# Altium project power-v3.6.PrjPCB (part 2 of 2)

## Sheet HV-Measurement.SchDoc
size A4; SheetNumber: 6
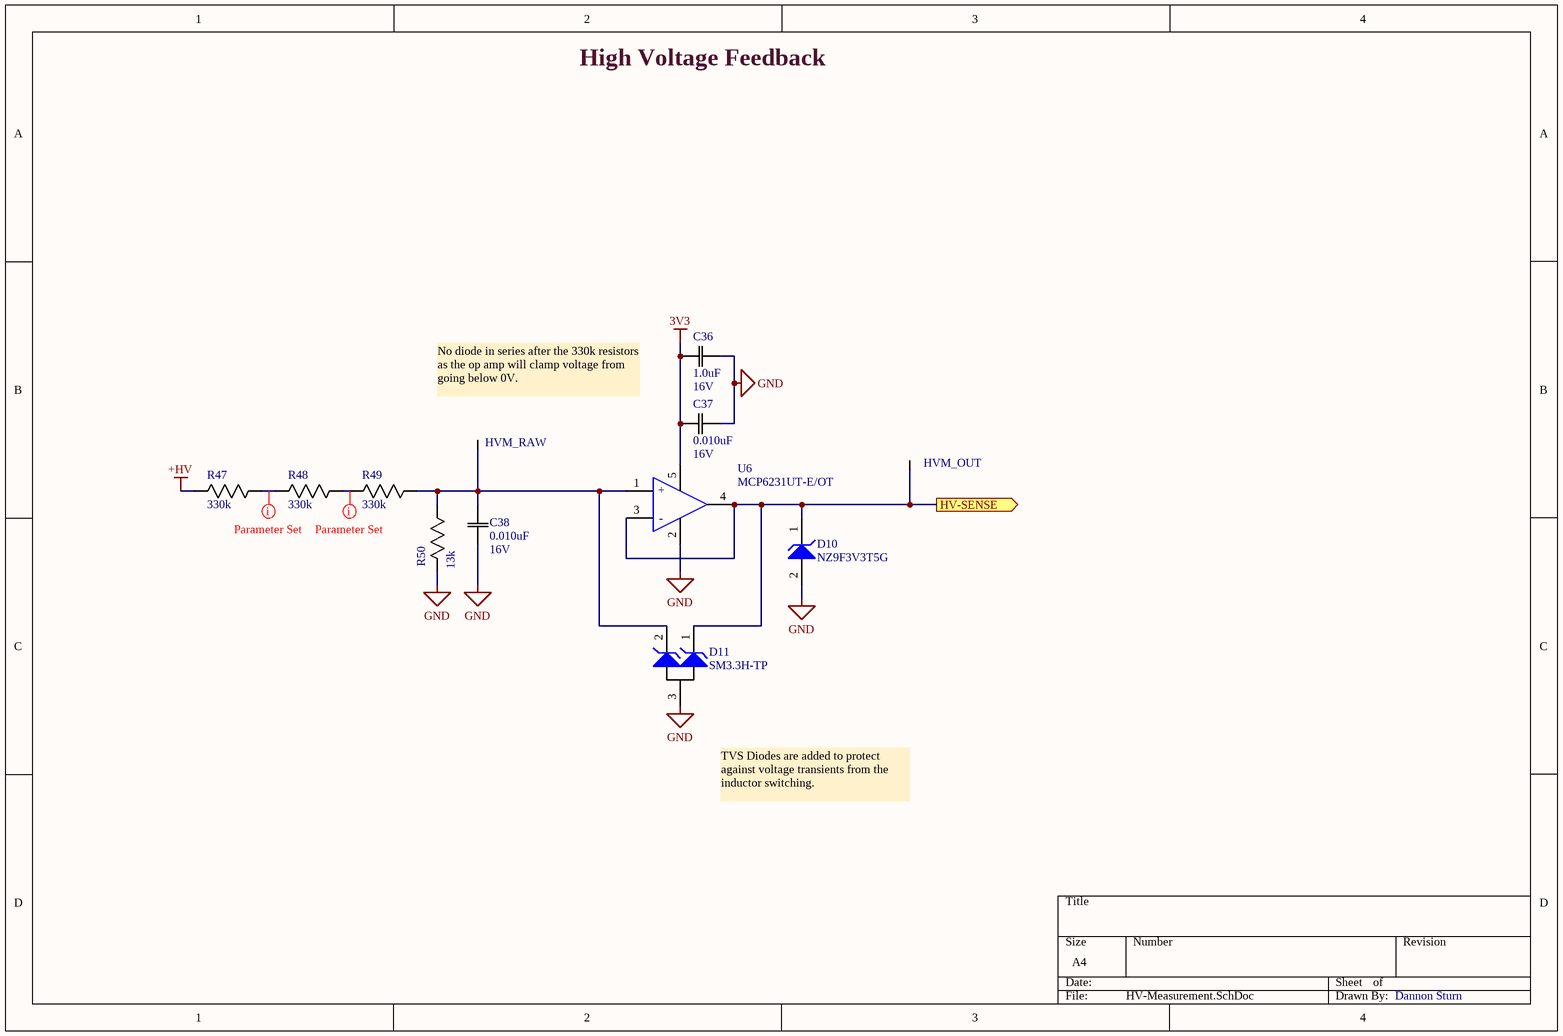
[diagram p7: HV-Measurement.SchDoc]

### Parts
C36  Rating: 16V  [0603]  (hidden comment: 1.0uF)
C37  Rating: 16V  [0603]  (hidden comment: 0.010uF)
C38  Rating: 16V  [0603]  (hidden comment: 0.010uF)
D10  NZ9F3V3T5G  [SOD-923_0P6X0P85_ONS]
D11  SM3.3H-TP  [SOT-23A-3]
HVM_OUT  Test Point (Via)  [TP]  (value not drawn)  (no BOM)
HVM_RAW  Test Point (Via)  [TP]  (value not drawn)  (no BOM)
R47  330k  [0603]
R48  330k  [0603]
R49  330k  [0603]
R50  13k  [0603]
U6  MCP6231UT-E/OT  [SOT-23-5_MC_MCH-L]

### Ports
HV-SENSE (out)

### Nets
3V3: C36.2(C2) C37.1(C1) U6.5(V+)
+HV: R47.2(R2)
GND: C36.1(C1) C37.2(C2) C38.1(C1) D10.2(A) D11.3 R50.2(R2) U6.2(V-)
HV-SENSE: D10.1(K) D11.1 HVM_OUT.1 U6.3(IN-) U6.4(OUT) ; port HV-SENSE
NetC38_2: C38.2(C2) D11.2 HVM_RAW.1 R49.1(R1) R50.1(R1) U6.1(IN+)
NetR47_1: R47.1(R1) R48.2(R2)
NetR48_1: R48.1(R1) R49.2(R2)

### Layout directives
net class HighVoltage: NetR47_1, NetR48_1

### Notes on the sheet
- High Voltage Feedback
- No diode in series after the 330k resistors as the op amp will clamp voltage from going below 0V.
- TVS Diodes are added to protect against voltage transients from the inductor switching.
- Dannon Sturn
- (in symbol OP AMP MCP6231UT-E_OT) +; -

### Library data of the parts
C36 = CAP 1.0uF 16V: CAP CER 1.0UF 16V X5R 0603/0805; Tolerance: 10%; Package: 0603/0805; Temperature Coefficient: X5R; Operating Temperature: -55°C ~ 85°C; Value: 1.0uF; Part Number: CAP 1.0uF 16V
C37 C38 = CAP 0.010uF 16V: CAP CER 0.010UF 16V X5R 0603; Tolerance: 10%; Temperature Coefficient: X5R; Value: 0.010uF; Part Number: CAP 0.010uF 16V; Package: 0603/0805; Operating Temperature: -55°C ~ 85°C
D10 = DIODE ZENER 3.3 200mW: Zener Diode 3.3 V 200 mW ±5% Surface Mount SOD-923; Mfr_Name: ON Semiconductor; Type: DEV; Copyright: Copyright (C) 2021 Ultra Librarian. All rights reserved.; Manufacturer_Part_Number: NZ9F3V3T5G; Digi-Key_Part_Number_1: NZ9F3V3T5GOSTR-ND; Digi-Key_Part_Number_2: NZ9F3V3T5GOSCT-ND; Digi-Key_Part_Number_3: NZ9F3V3T5GOSDKR-ND; RefDes: RefDes; Supplier 1: Digi-Key; Supplier Part Number 1: NZ9F3V3T5GOSCT-ND; Part Number: DIODE ZENER 3.3 200mW; Manufacturer Part Number 1: NZ9F3V3T5G; Supplier URL 1: https://www.digikey.com/en/products/detail/onsemi/NZ9F3V3T5G/1961325
D11 = DIODE TVS 3.3VR 3.5VBR: 3.3V Reverese Standoff, 3.5V Breakdown, 12.5V Clamp 40A (8/20µs) Ipp Tvs Diode SMD SOT-23; ComponentLink1Description: Octopart Link; ComponentLink1URL: https://octopart.com/search?q=SM3.3H-TP&currency=USD&specs=0; Part Number: DIODE TVS 3.3VR 3.5VBR; Manufacturer Part Number 1: SM3.3H-TP; Supplier 1: Digi-Key; Supplier Part Number 1: 353-SM3.3H-TPCT-ND; Supplier URL 1: https://www.digikey.com/en/products/detail/micro-commercial-co/SM3-3H-TP/12177181
R47-R49 = RES 330k 1/8W - 1%: RES SMD 274K OHM 1% 1/8W 0603; Part Number: RES 330k 1/8W - 1%
R50 = RES 13k 1/8W: RES SMD 13K OHM 5% 1/8W 0603; Power (Watts): 0.125W; Package: 0805; Value: 13k; Tolerance: 5%; Part Number: RES 13k 1/8W
U6 = OP AMP MCP6231UT-E_OT: Mfr_Name: Microchip; Copyright: Copyright (C) 2021 Ultra Librarian. All rights reserved.; Manufacturer_Part_Number: MCP6231UT-E/OT; Digi-Key_Part_Number_1: MCP6231UT-E/OTCT-ND; Digi-Key_Part_Number_2: MCP6231UT-E/OTDKR-ND; Digi-Key_Part_Number_3: MCP6231UT-E/OTTR-ND; RefDes: RefDes; Type: DEV; Supplier 1: Digi-key; Supplier Part Number 1: MCP6231UT-E/OTCT-ND; Part Number: OP AMP MCP6231UT-E_OT; Manufacturer Part Number 1: MCP6231UT-E/OT; Supplier URL 1: https://www.digikey.ca/en/products/detail/microchip-technology/MCP6231UT-E-OT/716023
HVM_OUT HVM_RAW = Test Point (Via): Part Number: Test Point (Via)

## Sheet power-input.SchDoc
size A4; SheetNumber: 2
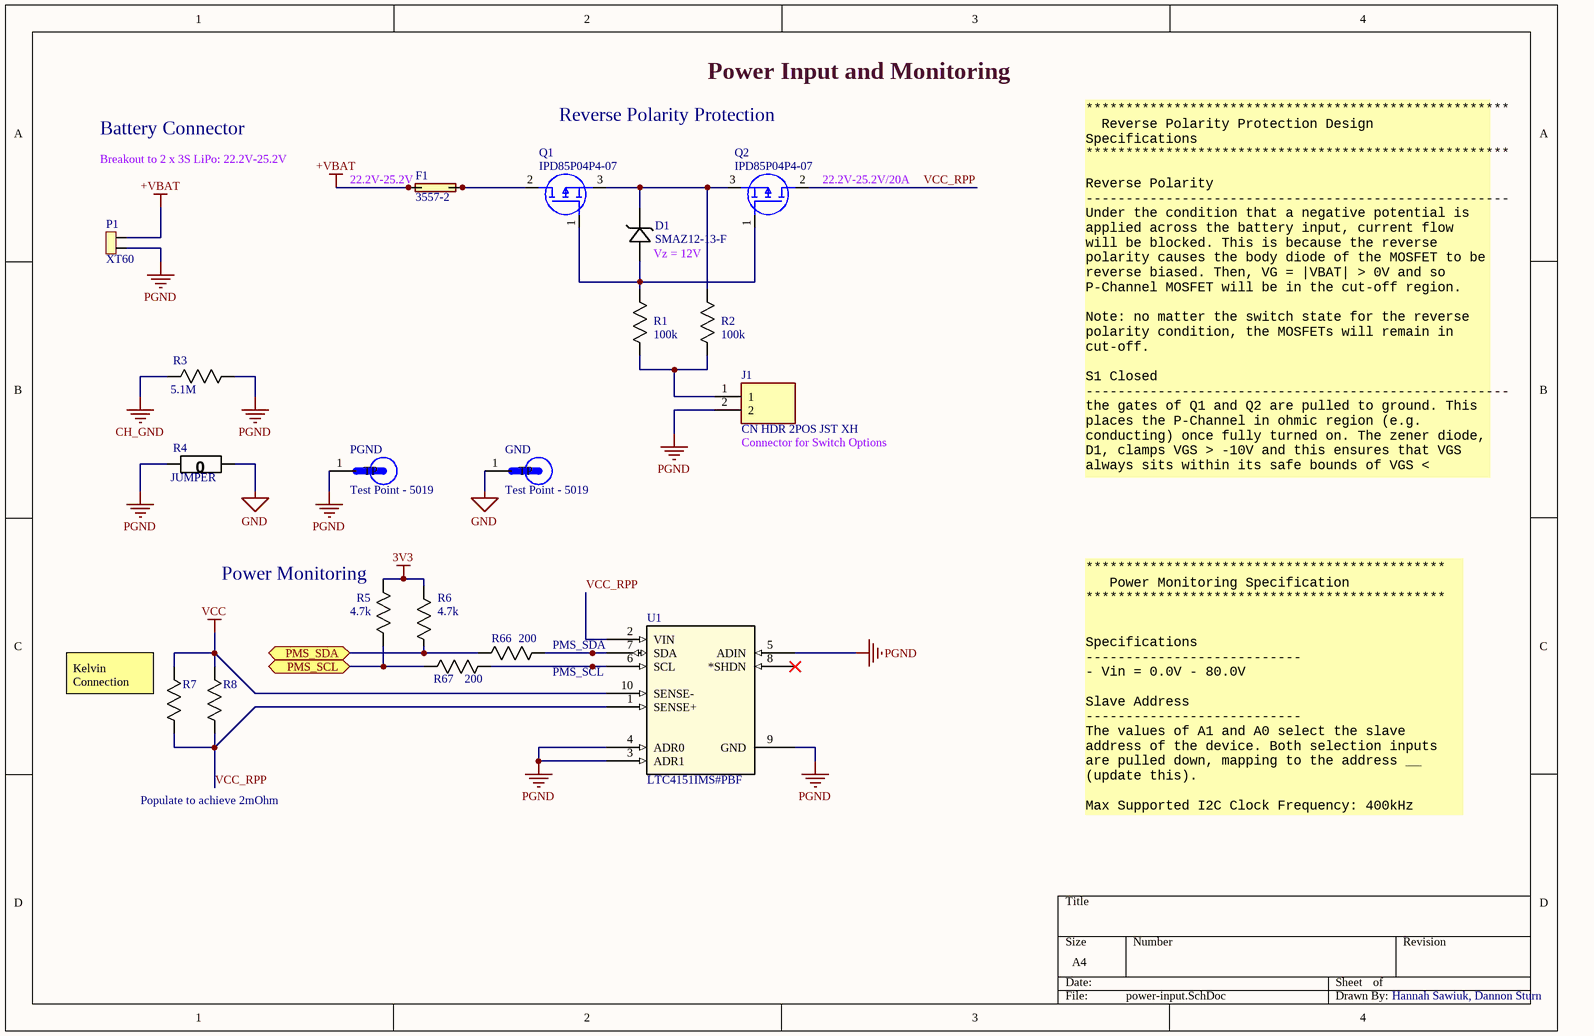
[diagram p8: power-input.SchDoc]

### Parts
D1  SMAZ12-13-F  [SMA_DIO-L]
F1  3557-2  [FUSE-3549-2]
GND  Test Point - 5019  [TP380X203]
J1  CN HDR 2POS JST XH  [JST_S2B-XH-A(LF)(SN)]
P1  XT60  [Amass_XT60PW-M]
PGND  Test Point - 5019  [TP380X203]
PMS_SCL  Test Point (Via)  [TP]  (value not drawn)  (no BOM)
PMS_SDA  Test Point (Via)  [TP]  (value not drawn)  (no BOM)
Q1  IPD85P04P4-07  [DPAK (TO-252)]
Q2  IPD85P04P4-07  [DPAK (TO-252)]
R1  100k  [0603]
R2  100k  [0603]
R3  5.1M  [0603]
R4  JUMPER  [1210]
R5  4.7k  [0603]
R6  4.7k  [0603]
R7  2mOHM  [2512]  (value not drawn)
R8  2mOHM  [2512]  (value not drawn)
R66  200  [0603]
R67  200  [0603]
U1  LTC4151IMS#PBF  [MSOP-10_MS_LIT]

### Ports
PMS_SCL (bidir), PMS_SDA (bidir)

### Nets
3V3: R5.2(R2) R6.2(R2)
+VBAT: F1.3(2A) F1.4(2B) P1.2
CH_GND: R3.2(R2)
GND: GND.1(TP) R4.1(R1)
PGND: J1.2 P1.1 PGND.1(TP) R3.1(R1) R4.2(R2) U1.3(ADR1) U1.4(ADR0) U1.5(ADIN) U1.9(GND)
VCC: R7.1(R1) R8.1(R1) U1.10(SENSE-)
PMS_SCL: R5.1(R1) R67.2(R2) ; port PMS_SCL
PMS_SDA: R6.1(R1) R66.2(R2) ; port PMS_SDA
VCC_RPP: Q2.2(D) R7.2(R2) R8.2(R2) U1.1(SENSE+) U1.2(VIN)
NetD1_1: D1.1 Q1.3(S) Q2.3(S) R2.1(R1)
NetD1_2: D1.2 Q1.1(G) Q2.1(G) R1.1(R1)
NetF1_1: F1.1(1A) F1.2(1B) Q1.2(D)
NetJ1_1: J1.1 R1.2(R2) R2.2(R2)
NetPMS_SCL_1: PMS_SCL.1 R67.1(R1) U1.6(SCL)
NetPMS_SDA_1: PMS_SDA.1 R66.1(R1) U1.7(SDA)

Not connected (* = marked no-connect by the designer): U1 8(*SHDN)*

### Notes on the sheet
- Power Input and Monitoring
- Battery Connector
- Breakout to 2 x 3S LiPo: 22.2V-25.2V
- Reverse Polarity Protection
- (near F1) 22.2V-25.2V
- (near Q2) 22.2V-25.2V/20A
- (near D1) Vz = 12V
- (near J1) Connector for Switch Options
- *****************************************************
  Reverse Polarity Protection Design Specifications
  *****************************************************
  Reverse Polarity
  -----------------------------------------------------
  Under the condition that a negative potential is applied across the battery input, current flow will be blocked. This is because the reverse polarity causes the body diode of the MOSFET to be reverse biased. Then, VG = |VBAT| > 0V and so P-Channel MOSFET will be in the cut-off region.
  Note: no matter the switch state for the reverse polarity condition, the MOSFETs will remain in cut-off.
  S1 Closed
  -----------------------------------------------------
  the gates of Q1 and Q2 are pulled to ground. This places the P-Channel in ohmic region (e.g. conducting) once fully turned on. The zener diode, D1, clamps VGS > -10V and this ensures that VGS always sits within its safe bounds of VGS < +5/-16V.
- (near R5) Power Monitoring
- (near R7) Kelvin Connection
- Populate to achieve 2mOhm
- *********************************************
  Power Monitoring Specification
  *********************************************
  Specifications
  ---------------------------
  - Vin = 0.0V - 80.0V
  Slave Address
  ---------------------------
  The values of A1 and A0 select the slave address of the device. Both selection inputs are pulled down, mapping to the address __ (update this).
  Max Supported I2C Clock Frequency: 400kHz
- Hannah Sawiuk, Dannon Sturn

### Library data of the parts
D1 = DIODE ZENER 12V 1W: Zener Diode 12 V 1 W ±5% Surface Mount SMA; Mfr_Name: Diodes Inc; Type: DEV; Copyright: Copyright (C) 2021 Ultra Librarian. All rights reserved.; Manufacturer_Part_Number: SMAZ12-13-F; Digi-Key_Part_Number_1: SMAZ12-FDICT-ND; Digi-Key_Part_Number_2: SMAZ12-FDIDKR-ND; Digi-Key_Part_Number_3: SMAZ12-FDITR-ND; RefDes: RefDes; Supplier 1: Digi-Key; Supplier 2: Newark; Supplier 3: Digi-Key; Supplier Part Number 1: SMAZ12-FDICT-ND; Supplier Part Number 2: 23T8541; Supplier Part Number 3: SMAZ12-FDICT-ND; Part Number: DIODE ZENER 12V 1W; Manufacturer Part Number 1: SMAZ12-13-F; Supplier URL 1: https://www.digikey.com/en/products/detail/SMAZ12-13-F/SMAZ12-FDICT-ND/725073?curr=usd&utm_campaign=buynow&utm_medium=aggregator&utm_source=octopart
F1 = FUSE BLADE: Fuse Block 30A 500V 1 Circuit Blade Through Hole; MF: Keystone Electronics; Package: Nonstandard Keystone; Value: *; Price: None; MP: 3557-2; SnapEDA_Link: https://www.snapeda.com/parts/3557-2/Keystone%20Electronics/view-part/278060/?ref=snap; Supplier 1: Digi-Key; Supplier Part Number 1: 36-3557-2-ND; Part Number: FUSE BLADE; Pin Count: 4
GND PGND = Test Point - 5019: PC Test Point, Miniature Phosphor Bronze, Silver Plating Surface Mount Mounting Type; MP: 5019; MF: Keystone Electronics; Value: *; Package: 2010 Keystone; Part Number: Test Point - 5019
J1 = CN HDR 2POS JST XH: Connector Header Through Hole 2 position 0.098 _2.50mm_ / JST XH; MP: B2B-XH-A_LF__SN_; MF: JST Sales; Price: None; Package: None; Value: *; SnapEDA_Link: https://www.snapeda.com/parts/B2B-XH-A%28LF%29%28SN%29/JST%20Sales%20America%20Inc./view-part/492310/?ref=snap; Part Number: CN HDR 2POS JST XH; Pin Count: 2
P1 = XT60 Connector: XT60 CONNECTORS FEMALE PAIR; MF: SparkFun Electronics; MP: PRT-10474; Digikey: 1568-1816-ND; Digikey Link: https://www.digikey.ca/product-detail/en/sparkfun-electronics/PRT-10474/1568-1816-ND/8258064; Package: XT60; Price: 2.13000 CAD; Value: N/A; Supplier 1: Digi-Key; Supplier Part Number 1: 1568-1816-ND; Part Number: XT60 Connector; Supplier URL 1: https://www.digikey.ca/product-detail/en/sparkfun-electronics/PRT-10474/1568-1816-ND/8258064; Pin Count: 2
Q1 Q2 = MOSFET IPD85P04P4-07: P-Channel 40 V 85A (Tc) 88W (Tc) Surface Mount PG-TO252-3-313; Supplier 1: Digi-Key; Supplier 2: Mouser; Supplier 3: Digi-Key; Supplier Part Number 1: 448-IPD85P04P407ATMA1CT-ND; Supplier Part Number 2: 726-IPD85P04P4-07; Supplier Part Number 3: 448-IPD85P04P407ATMA1CT-ND; Part Number: MOSFET IPD85P04P4-07; Supplier URL 1: https://www.digikey.ca/en/products/detail/infineon-technologies/IPD85P04P407ATMA1/5960266
R1 R2 = RES 100k 1/8W - 1%: RES SMD 100K OHM 1% 1/8W 0603; Manufacturer Part Number 1: ERJ-H3GJ104V; Power (Watts): 0.125W; Package: 0805; Value: 100k; Tolerance: 1%; Part Number: RES 100k 1/8W - 1%; Supplier 1: Digi-Key; Supplier Part Number 1: 10-ERJ-H3GJ104VCT-ND; Supplier URL 1: https://www.digikey.ca/en/products/detail/panasonic-electronic-components/ERJ-H3GJ104V/13877854?s=N4IgTCBcDaIIwAYC0BRASgKSQCQMwHENEAWANQGEAVJAOQBEQBdAXyA
R3 = RES 5.1M 1/8W-5%: RES SMD 5.1 MOHM 5% 1/8W 0603; Power (Watts): 0.125W; Package: 0805; Value: 5.1M; Tolerance: 5%; Part Number: RES 5.1M 1/8W-5%
R4 = RES 0 JUMPER: RES SMD 0 OHM JUMPER GENERIC 0603; Value: 0; Package: 0805; Part Number: RES 0 JUMPER; Tolerance: N/A
R5 R6 = RES 4.7k 1/8W - 5%: RES SMD 4.7k OHM 5% 1/8W 0603; Manufacturer Part Number 1: RMCF0603JT4K70; Power (Watts): 0.125W; Package: 0805; Value: 4.7k; Tolerance: 5%; Part Number: RES 4.7k 1/8W - 5%; Supplier 1: Digi-Key; Supplier Part Number 1: RMCF0603JT4K70CT-ND; Supplier URL 1: https://www.digikey.ca/en/products/detail/stackpole-electronics-inc/RMCF0603JT4K70/1757976
R7 R8 = RES 2m 1W: RES SMD 2m OHM 1% 1W 2512; Package: 1206; Power (Watts): 1W; Tolerance: 1%; Part Number: RES 2m 1W
R66 R67 = RES 200.0 1/8W: RES SMD 200 OHM 5% 1/8W 0603; Power (Watts): 0.125W; Package: 0603; Value: 200; Tolerance: 5%; Part Number: RES 200.0 1/8W
U1 = ltc4151ims#pbf: IC CURRENT MONITOR(12BIT) 10MSOP; Mfr_Name: Analog Devices / Linear Technology; Copyright: Copyright (C) 2021 Ultra Librarian. All rights reserved.; Manufacturer_Part_Number: ltc4151ims#pbf; Digi-Key_Part_Number_1: LTC4151IMS#PBF-ND; RefDes: RefDes; Type: DEV; Supplier 1: Digi-key; Supplier Part Number 1: LTC4151IMS#PBF-ND; Part Number: ltc4151ims#pbf; Manufacturer Part Number 1: ltc4151ims#pbf; Supplier URL 1: https://www.digikey.ca/en/products/detail/analog-devices-inc/LTC4151IMS-PBF/1814473?s=N4IgTCBcDaIDIBUDCAWAjAVjQSQLIGUBiABQCEAxEAXQF8g
PMS_SCL PMS_SDA = Test Point (Via): Part Number: Test Point (Via)

## Sheet Power-MCU-Breakout.SchDoc
size B
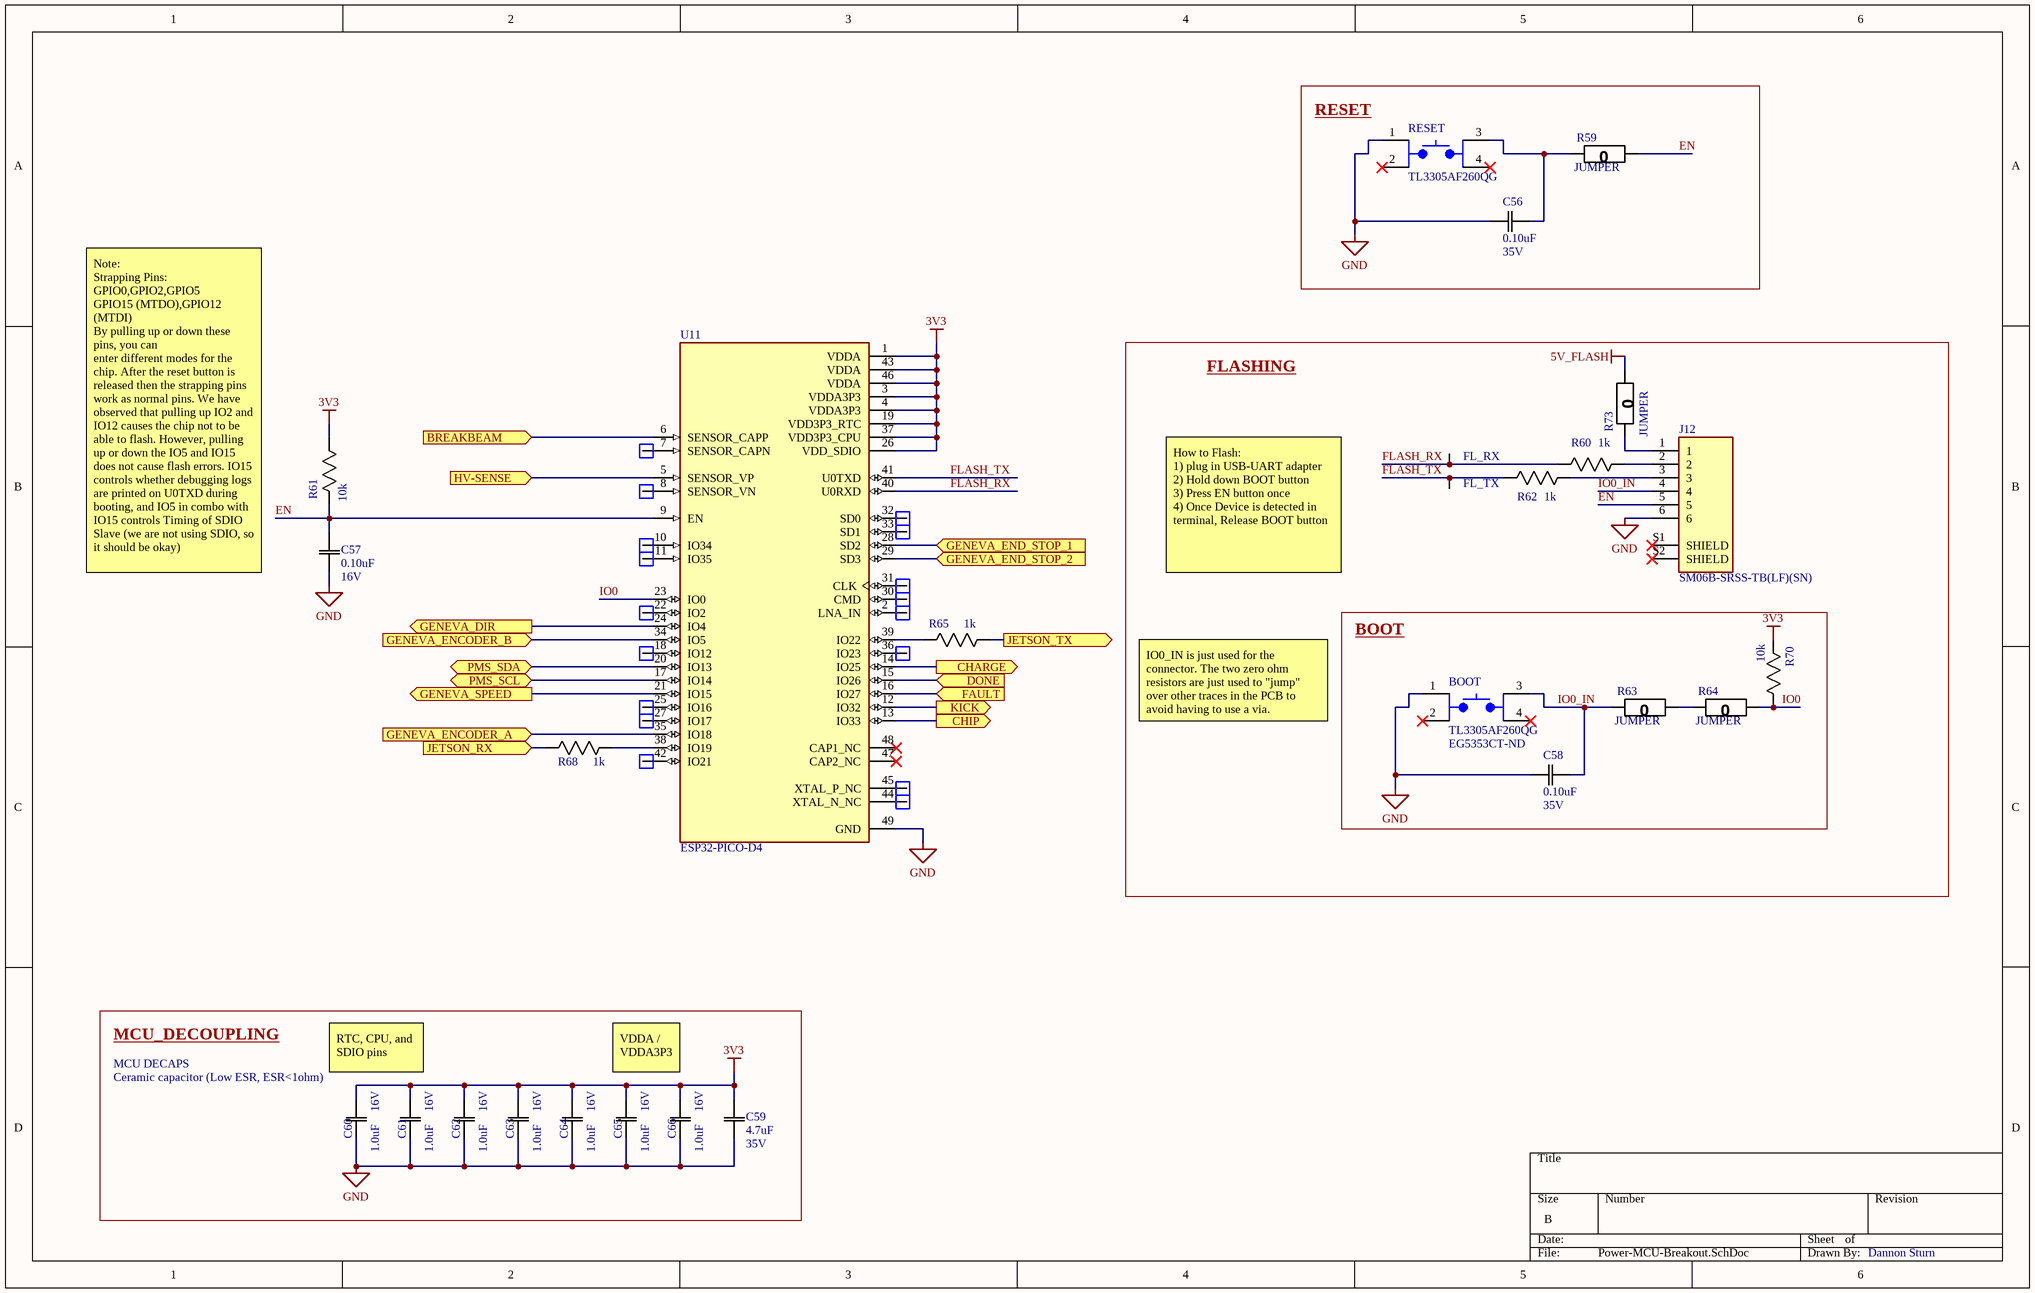
[diagram p9: Power-MCU-Breakout.SchDoc]

### Parts
(Parts that share a designator on the sheet are numbered #1, #2 ... from top to bottom, then left to right.)
2  Breakout Pin 0603  [BreakoutPin 0603]  (value not drawn)
7  Breakout Pin 0603  [BreakoutPin 0603]  (value not drawn)
8  Breakout Pin 0603  [BreakoutPin 0603]  (value not drawn)
10  Breakout Pin 0603  [BreakoutPin 0603]  (value not drawn)
11  Breakout Pin 0603  [BreakoutPin 0603]  (value not drawn)
18  Breakout Pin 0603  [BreakoutPin 0603]  (value not drawn)
22  Breakout Pin 0603  [BreakoutPin 0603]  (value not drawn)
25  Breakout Pin 0603  [BreakoutPin 0603]  (value not drawn)
27  Breakout Pin 0603  [BreakoutPin 0603]  (value not drawn)
30  Breakout Pin 0603  [BreakoutPin 0603]  (value not drawn)
31  Breakout Pin 0603  [BreakoutPin 0603]  (value not drawn)
32  Breakout Pin 0603  [BreakoutPin 0603]  (value not drawn)
33  Breakout Pin 0603  [BreakoutPin 0603]  (value not drawn)
36  Breakout Pin 0603  [BreakoutPin 0603]  (value not drawn)
42  Breakout Pin 0603  [BreakoutPin 0603]  (value not drawn)
44  Breakout Pin 0603  [BreakoutPin 0603]  (value not drawn)
45  Breakout Pin 0603  [BreakoutPin 0603]  (value not drawn)
BOOT  TL3305AF260QG  Supplier Part Number 1: EG5353CT-ND  [SW_TL3305AF260QG]
C56  Rating: 35V  [0603]  (hidden comment: 0.10uF)
C57  Rating: 16V  [0603]  (hidden comment: 0.10uF)
C58  Rating: 35V  [0603]  (hidden comment: 0.10uF)
C59  Rating: 35V  [0603]  (hidden comment: 4.7uF)
C60  Rating: 16V  [0603]  (hidden comment: 1.0uF)
C61  Rating: 16V  [0603]  (hidden comment: 1.0uF)
C62  Rating: 16V  [0603]  (hidden comment: 1.0uF)
C63  Rating: 16V  [0603]  (hidden comment: 1.0uF)
C64  Rating: 16V  [0603]  (hidden comment: 1.0uF)
C65  Rating: 16V  [0603]  (hidden comment: 1.0uF)
C66  Rating: 16V  [0603]  (hidden comment: 1.0uF)
FL_RX  Test Point (Via)  [TP]  (value not drawn)  (no BOM)
FL_TX  Test Point (Via)  [TP]  (value not drawn)  (no BOM)
J12  SM06B-SRSS-TB(LF)(SN)  [JST_SM06B-SRSS-TB(LF)(SN)]
R59  JUMPER  [0603]
R60  1k  [0603]
R61  10k  [0603]
R62#2  1k  [0603]
R63  JUMPER  [0603]
R64  JUMPER  [0603]
R65  1k  [0603]
R68  1k  [0603]
R70  10k  [0603]
R73  JUMPER  [0603]
RESET  TL3305AF260QG  [SW_TL3305AF260QG]
U11  ESP32-PICO-D4  [PQFN50P700X700X104-49N - BigPads]

### Blocks framed on the sheet
RESET: C56 R59 RESET
FLASHING: FL_RX FL_TX J12 R60 R62#2 R73
BOOT: BOOT C58 R63 R64 R70
MCU_DECOUPLING: C59-C66

### Ports
BREAKBEAM (in), CHARGE (out), CHIP (out), DONE (in), FAULT (in), GENEVA_DIR (out), GENEVA_ENCODER_A (in), GENEVA_ENCODER_B (in), GENEVA_END_STOP_1 (in), GENEVA_END_STOP_2 (in), GENEVA_SPEED (out), HV-SENSE (in), JETSON_RX (in), JETSON_TX (out), KICK (out), PMS_SCL (bidir), PMS_SDA (bidir)

### Nets
3V3: C59.2(C2) C60.2(C2) C61.2(C2) C62.2(C2) C63.2(C2) C64.2(C2) C65.2(C2) C66.2(C2) R61.1(R1) R70.2(R2) U11.1(VDDA) U11.3(VDDA3P3) U11.4(VDDA3P3) U11.19(VDD3P3_RTC) U11.26(VDD_SDIO) U11.37(VDD3P3_CPU) U11.43(VDDA) U11.46(VDDA)
5V_FLASH: R73.1(R1)
GND: BOOT.1 C56.1(C1) C57.1(C1) C58.1(C1) C59.1(C1) C60.1(C1) C61.1(C1) C62.1(C1) C63.1(C1) C64.1(C1) C65.1(C1) C66.1(C1) J12.6 RESET.1 U11.49(GND)
BREAKBEAM: U11.6(SENSOR_CAPP) ; port BREAKBEAM
CHARGE: U11.14(IO25) ; port CHARGE
CHIP: U11.13(IO33) ; port CHIP
DONE: U11.15(IO26) ; port DONE
EN: C57.2(C2) J12.5 R59.1(R1) R61.2(R2) U11.9(EN)
FAULT: U11.16(IO27) ; port FAULT
FLASH_RX: FL_RX.1 R60.2(R2) U11.40(U0RXD)
FLASH_TX: FL_TX.1 R62#2.2(R2) U11.41(U0TXD)
GENEVA_DIR: U11.24(IO4) ; port GENEVA_DIR
GENEVA_ENCODER_A: U11.35(IO18) ; port GENEVA_ENCODER_A
GENEVA_ENCODER_B: U11.34(IO5) ; port GENEVA_ENCODER_B
GENEVA_END_STOP_1: U11.28(SD2) ; port GENEVA_END_STOP_1
GENEVA_END_STOP_2: U11.29(SD3) ; port GENEVA_END_STOP_2
GENEVA_SPEED: U11.21(IO15) ; port GENEVA_SPEED
HV-SENSE: U11.5(SENSOR_VP) ; port HV-SENSE
IO0: R64.1(R1) R70.1(R1) U11.23(IO0)
IO0_IN: BOOT.3 C58.2(C2) J12.4 R63.2(R2)
JETSON_RX: R68.2(R2) ; port JETSON_RX
JETSON_TX: R65.1(R1) ; port JETSON_TX
KICK: U11.12(IO32) ; port KICK
PMS_SCL: U11.17(IO14) ; port PMS_SCL
PMS_SDA: U11.20(IO13) ; port PMS_SDA
Net2_1: 2.1(BRKOUT) U11.2(LNA_IN)
Net7_1: 7.1(BRKOUT) U11.7(SENSOR_CAPN)
Net8_1: 8.1(BRKOUT) U11.8(SENSOR_VN)
Net10_1: 10.1(BRKOUT) U11.10(IO34)
Net11_1: 11.1(BRKOUT) U11.11(IO35)
Net18_1: 18.1(BRKOUT) U11.18(IO12)
Net22_1: 22.1(BRKOUT) U11.22(IO2)
Net25_1: 25.1(BRKOUT) U11.25(IO16)
Net27_1: 27.1(BRKOUT) U11.27(IO17)
Net30_1: 30.1(BRKOUT) U11.30(CMD)
Net31_1: 31.1(BRKOUT) U11.31(CLK)
Net32_1: 32.1(BRKOUT) U11.32(SD0)
Net33_1: 33.1(BRKOUT) U11.33(SD1)
Net36_1: 36.1(BRKOUT) U11.36(IO23)
Net42_1: 42.1(BRKOUT) U11.42(IO21)
Net44_1: 44.1(BRKOUT) U11.44(XTAL_N_NC)
Net45_1: 45.1(BRKOUT) U11.45(XTAL_P_NC)
NetC56_2: C56.2(C2) R59.2(R2) RESET.3
NetJ12_1: J12.1 R73.2(R2)
NetJ12_2: J12.2 R60.1(R1)
NetJ12_3: J12.3 R62#2.1(R1)
NetR63_1: R63.1(R1) R64.2(R2)
NetR65_2: R65.2(R2) U11.39(IO22)
NetR68_1: R68.1(R1) U11.38(IO19)

Not connected (* = marked no-connect by the designer): BOOT 2* 4*; J12 S1(SHIELD)* S2(SHIELD)*; RESET 2* 4*; U11 47(CAP2_NC)* 48(CAP1_NC)*

### Notes on the sheet
- Note:
  Strapping Pins:
  GPIO0,GPIO2,GPIO5
  GPIO15 (MTDO),GPIO12 (MTDI)
  By pulling up or down these pins, you can
  enter different modes for the chip. After the reset button is released then the strapping pins work as normal pins. We have observed that pulling up IO2 and IO12 causes the chip not to be able to flash. However, pulling up or down the IO5 and IO15 does not cause flash errors. IO15 controls whether debugging logs are printed on U0TXD during booting, and IO5 in combo with IO15 controls Timing of SDIO Slave (we are not using SDIO, so it should be okay)
- How to Flash:
  1) plug in USB-UART adapter
  2) Hold down BOOT button
  3) Press EN button once
  4) Once Device is detected in terminal, Release BOOT button
- IO0_IN is just used for the connector. The two zero ohm resistors are just used to "jump" over other traces in the PCB to avoid having to use a via.
- MCU DECAPS
- (near C60) Ceramic capacitor (Low ESR, ESR<1ohm)
- RTC, CPU, and SDIO pins
- VDDA / VDDA3P3
- Dannon Sturn

### Library data of the parts
2 7 8 10 11 18 22 25 27 30-33 36 42 44 45 = Breakout Pin 0603: 0603 breakout pad; Part Number: Breakout Pin 0603
BOOT RESET = SW PUSH TACT NO SMD: Tactile Switch SPST-NO Top Actuated Surface Mount; MF: E-Switch; Price: None; Value: *; MP: TL3305AF260QG; Package: LQFP-48 E-Switch; SnapEDA_Link: https://www.snapeda.com/parts/TL3305AF260QG/E-Switch/view-part/479903/?ref=snap; Availability: Unavailable; Supplier 1: Digi-key; Part Number: SW PUSH TACT NO SMD; Manufacturer Part Number 1: TL3305AF260QG; Supplier URL 1: https://www.digikey.com/en/products/detail/e-switch/TL3305AF260QG/5816184
  RESET: Supplier Part Number 1: EG5353CT-ND
C56 C58 = CAP 0.10uF 35V: CAP CER 0.10UF 35V X7R 0603; Manufacturer Part Number 1: GMK107B7104KAHT; Tolerance: 10%; Package: 0603/0805; Temperature Coefficient: X7R; Operating Temperature: -55°C ~ 125°C; Value: 0.10uF; Part Number: CAP 0.10uF 35V; Supplier 1: Digi-Key; Supplier Part Number 1: 587-3354-1-ND; Manufacturer Part Number 2: GMK212BJ104KGHT; Supplier 2: Digi-Key; Supplier Part Number 2: 587-3364-1-ND
C57 = CAP 0.10uF 16V: CAP CER 0.10UF 16V X5R 0603; Tolerance: 10%; Package: 0603/0805; Temperature Coefficient: X5R; Operating Temperature: -55°C ~ 85°C; Value: 0.10uF; Part Number: CAP 0.10uF 16V
C59 = CAP 4.7uF 35V: CAP CER 4.7UF 35V X7R 0603/0805; Tolerance: 10%; Package: 0603/0805; Temperature Coefficient: X7R; Operating Temperature: -55°C ~ 125°C; Value: 4.7uF; Part Number: CAP 4.7uF 35V
C60-C66 = CAP 1.0uF 16V: as C36 on sheet HV-Measurement; Package: 0603/0805; Temperature Coefficient: X5R; Operating Temperature: -55°C ~ 85°C; Value: 1.0uF; Part Number: CAP 1.0uF 16V
J12 = CN 6POS JST SR SMT: Connector Header Surface Mount, Right Angle 6 position 0.039 _1.00mm_; MP: SM06B-SRSS-TB_LF__SN_; MF: JST Sales; Package: None; Value: *; SnapEDA_Link: https://www.snapeda.com/parts/SM06B-SRSS-TB%28LF%29%28SN%29/JST%20Sales%20America%20Inc./view-part/554386/?ref=snap; Digi-Key_Purchase_URL: https://www.digikey.com/product-detail/en/jst-sales-america-inc/SM06B-SRSS-TB_LF__SN_/455-1806-1-ND/926877?utm_source=snapeda&utm_medium=aggregator&utm_campaign=symbol; Digi-Key_Part_Number: 455-1806-1-ND; Supplier 1: Digi-Key; Supplier Part Number 1: 455-1806-1-ND; Part Number: CN 6POS JST SR SMT; Manufacturer Part Number 1: SM06B-SRSS-TB(LF)(SN); Supplier URL 1: https://www.digikey.com/en/products/detail/jst-sales-america-inc/SM06B-SRSS-TB-LF-SN/926712
R59 R63 R64 R73 = RES 0 JUMPER: RES SMD 0 OHM JUMPER GENERIC 0603; Manufacturer Part Number 1: RK73Z1JTTD; Value: 0; Package: 0805; Part Number: RES 0 JUMPER; Tolerance: N/A; Supplier 1: Digi-Key; Supplier Part Number 1: 2019-RK73Z1JTTDCT-ND; Supplier URL 1: https://www.digikey.ca/en/products/detail/koa-speer-electronics-inc/RK73Z1JTTD/9845478
R60 R62#2 R65 R68 = RES 1k 1/8W: RES SMD 1K OHM 1% 1/8W 0603; Manufacturer Part Number 1: MCT06030C1001FP500; Power (Watts): 0.125W; Package: 0805; Value: 1k; Tolerance: 1%; Part Number: RES 1k 1/8W; Supplier 1: Digi-Key; Supplier Part Number 1: MCT0603-1.00K-CFCT-ND; Supplier URL 1: https://www.digikey.ca/en/products/detail/vishay-beyschlag-draloric-bc-components/MCT06030C1001FP500/2607821?s=N4IgTCBcDaILIGEAqAGAbCgzAWgIwDoUUBpbBAMWWwDkAREAXQF8g
R61 R70 = RES 10k 1/8W - 5%: RES SMD 10K OHM 5% 1/8W 0603; Power (Watts): 0.125W; Package: 0805; Value: 10k; Tolerance: 5%; Part Number: RES 10k 1/8W - 5%
U11 = ESP32-PICO-D4: RX TXRX MOD WIFI SURFACE MOUNT; MF: Espressif Systems; MP: ESP32-PICO-D4; Package: SMD-48 Espressif Systems; Availability: Warning; Price: None; Purchase-URL: https://pricing.snapeda.com/search/part/ESP32-PICO-D4/?ref=eda; Check_prices: https://www.snapeda.com/parts/ESP32-PICO-D4/Espressif%20Systems/view-part/2762121/?ref=eda; SnapEDA_Link: https://www.snapeda.com/parts/ESP32-PICO-D4/Espressif%20Systems/view-part/2762121/?ref=snap; Value: *; Part Number: ESP32-PICO-D4; Manufacturer Part Number 1: ESP32-PICO-D4; Supplier 1: Digi-key; Supplier Part Number 1: 1904-1029-1-ND; Supplier URL 1: https://www.digikey.com/en/products/detail/espressif-systems/ESP32-PICO-D4/9381722
FL_RX FL_TX = Test Point (Via): Part Number: Test Point (Via)

## Sheet regulation.SchDoc
size A4; SheetNumber: 3
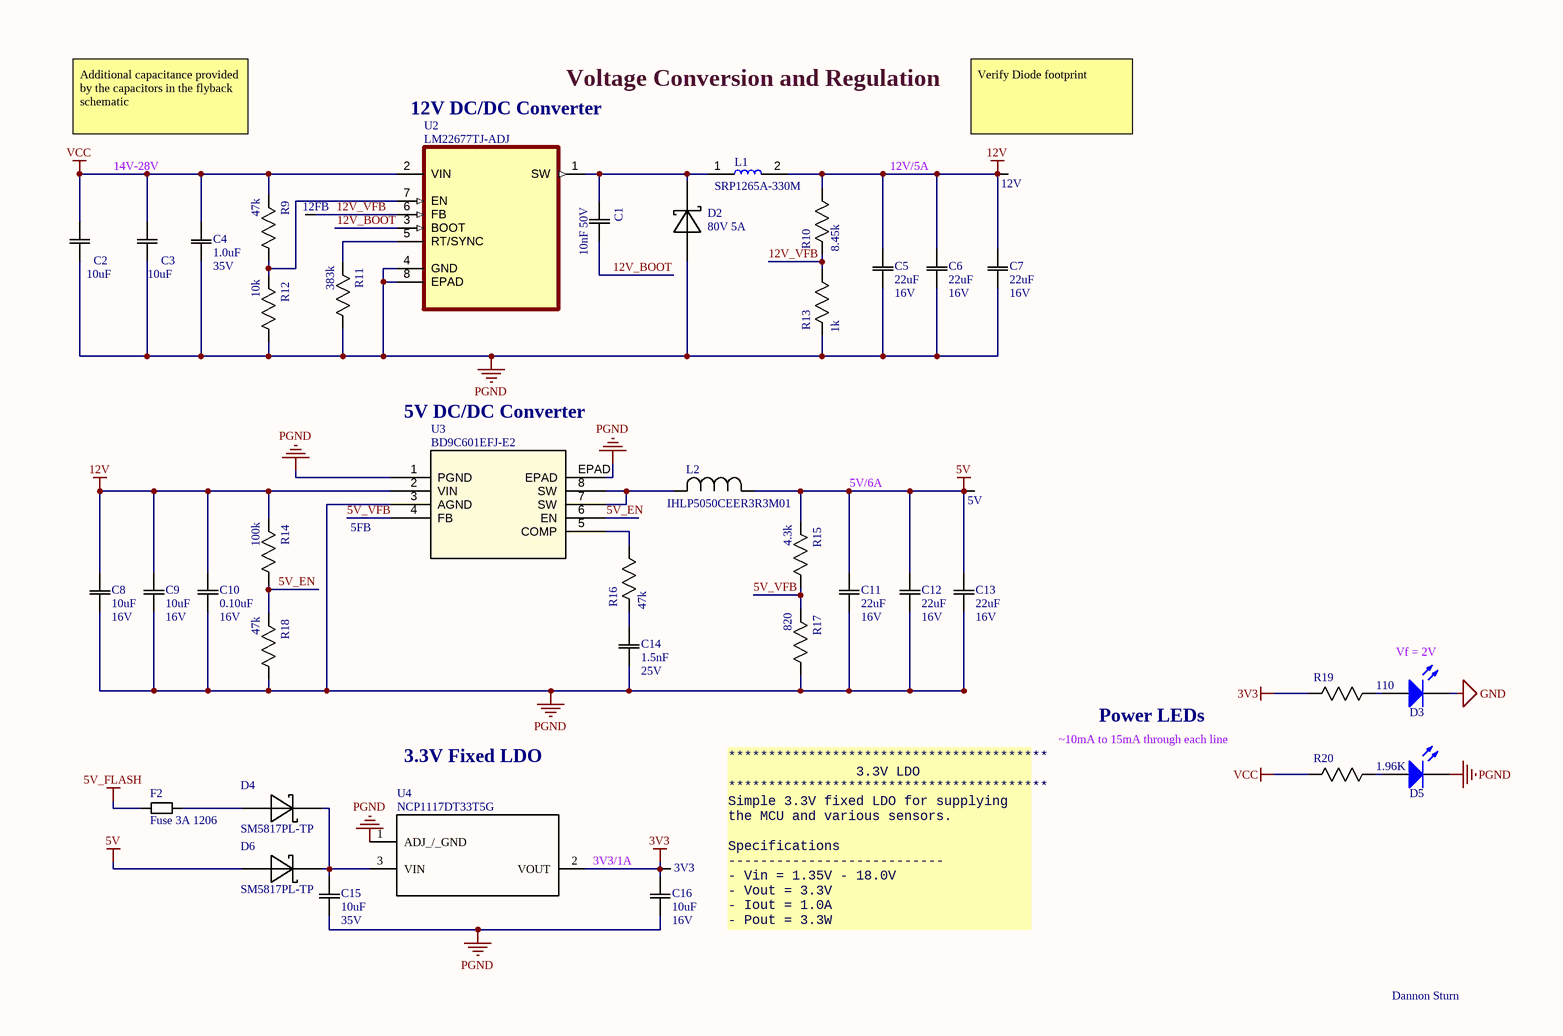
[diagram p10: regulation.SchDoc]

### Parts
(Parts that share a designator on the sheet are numbered #1, #2 ... from top to bottom, then left to right.)
3V3  Test Point (Via)  [TP]  (value not drawn)  (no BOM)
5FB  Test Point (Via)  [TP]  (value not drawn)  (no BOM)
5V  Test Point (Via)  [TP]  (value not drawn)  (no BOM)
12FB  Test Point (Via)  [TP]  (value not drawn)  (no BOM)
12V  Test Point (Via)  [TP]  (value not drawn)  (no BOM)
C1  10nF 50V  [0603]
C2  10uF  [0805]
C3  10uF  [0805]
C4  Rating: 35V  [0805]  (hidden comment: 1.0uF)
C5  Rating: 16V  [0805]  (hidden comment: 22uF)
C6  Rating: 16V  [0805]  (hidden comment: 22uF)
C7  Rating: 16V  [0805]  (hidden comment: 22uF)
C8  Rating: 16V  [0603]  (hidden comment: 10uF)
C9  Rating: 16V  [0603]  (hidden comment: 10uF)
C10  Rating: 16V  [0603]  (hidden comment: 0.10uF)
C11  Rating: 16V  [0805]  (hidden comment: 22uF)
C12  Rating: 16V  [0805]  (hidden comment: 22uF)
C13  Rating: 16V  [0805]  (hidden comment: 22uF)
C14  Rating: 25V  [0603]  (hidden comment: 1.5nF)
C15  Rating: 35V  [0805]  (hidden comment: 10uF)
C16  Rating: 16V  [0603]  (hidden comment: 10uF)
D2  80V 5A  [DIOSC6959X240]
D3  LED2  [3.2X1.6X1.1]  (value not drawn)
D4  SM5817PL-TP  [SOD-123]
D5  LED2  [3.2X1.6X1.1]  (value not drawn)
D6  SM5817PL-TP  [SOD-123]
F2  Fuse 3A 1206  [1206]
L1  SRP1265A-330M  [IND_SRP1265A-330M]
L2  IHLP5050CEER3R3M01  [IND_IHLP-5050CE_VIS]
R9  47k  [0603]
R10  8.45k  [0603]
R11  383k  [0603]
R12  10k  [0603]
R13  1k  [0603]
R14  100k  [0603]
R15  4.3k  [0603]
R16  47k  [0603]
R17  820  [0603]
R18#2  47k  [0603]
R19  110  [0603]
R20  1.96K  [0603]
U2  LM22677TJ-ADJ  [TO127P1435X210-8N]
U3  BD9C601EFJ-E2  [HTSOP-J8_ROM-BD9C601EFJ-E2]
U4  NCP1117DT33T5G  [DPAK (TO-252)]

### Nets
3V3: 3V3.1 C16.2(C2) R19.2(R2) U4.2(VOUT)
5V: 5V.1 C11.1(C1) C12.1(C1) C13.1(C1) D6.A L2.1 R15.2(R2)
5V_FLASH: F2.1
12V: 12V.1 C5.2(C2) C6.2(C2) C7.2(C2) C8.2(C2) C9.1(C1) C10.1(C1) L1.2 R10.1(R1) R14.2(R2) U3.2(VIN)
GND: D3.2(K)
PGND: C2.2(C2) C3.2(C2) C4.1(C1) C5.1(C1) C6.1(C1) C7.1(C1) C8.1(C1) C9.2(C2) C10.2(C2) C11.2(C2) C12.2(C2) C13.2(C2) C14.1(C1) C15.2(C2) C16.1(C1) D2.A D5.2(K) R11.1(R1) R12.1(R1) R13.2(R2) R17.1(R1) R18#2.1(R1) U2.4(GND) U2.8(EPAD) U3.1(PGND) U3.3(AGND) U3.EPAD U4.1(ADJ_/_GND)
VCC: C2.1(C1) C3.1(C1) C4.2(C2) R9.2(R2) R20.2(R2) U2.2(VIN)
5V_EN: R14.1(R1) R18#2.2(R2) U3.6(EN)
5V_VFB: 5FB.1 R15.1(R1) R17.2(R2) U3.4(FB)
12V_BOOT: C1.2(C2) U2.3(BOOT)
12V_VFB: 12FB.1 R10.2(R2) R13.1(R1) U2.6(FB)
NetC1_1: C1.1(C1) D2.C(K) L1.1 U2.1(SW)
NetC14_2: C14.2(C2) R16.2(R2)
NetC15_1: C15.1(C1) D4.C(K) D6.C(K) U4.3(VIN)
NetD3_1: D3.1(A) R19.1(R1)
NetD4_A: D4.A F2.2
NetD5_1: D5.1(A) R20.1(R1)
NetL2_2: L2.2 U3.7(SW) U3.8(SW)
NetR9_1: R9.1(R1) R12.2(R2) U2.7(EN)
NetR11_2: R11.2(R2) U2.5(RT/SYNC)
NetR16_1: R16.1(R1) U3.5(COMP)

### Notes on the sheet
- 12V DC/DC Converter
- Voltage Conversion and Regulation
- Additional capacitance provided by the capacitors in the flyback schematic
- 14V-28V
- 12V/5A
- (near 12V) Verify Diode footprint
- 5V DC/DC Converter
- 5V/6A
- Vf = 2V
- 3.3V Fixed LDO
- ~10mA to 15mA through each line
- Power LEDs
- 3V3/1A
- ****************************************
  3.3V LDO
  ****************************************
  Simple 3.3V fixed LDO for supplying the MCU and various sensors.
  Specifications
  ---------------------------
  - Vin = 1.35V - 18.0V
  - Vout = 3.3V
  - Iout = 1.0A
  - Pout = 3.3W
- Dannon Sturn
- DWG NO:
- REV:
- THIS DOCUMENT AND THE DATA DISCLOSED HEREIN OR
- HEREWITH IS THE PROPERTY OF ALTIUM LIMITED AND MAY
- BE FREELY DISTRIBUTED IN WHOLE. NO RIGHTS ARE
- RESERVED OR EXPRESS OR IMPLIED WARANTEE GIVEN.
- REVISION
- DESCRIPTION
- DATE
- APPROVED
- ENG:
- APPROVALS
- PROJECT
- DSN:
- CHK:
- REFERENCE DOCUMENTS
- PROJECT REVISION:
- TITLE
- DOCUMENT REVISION:
- DESIGN ITEM:
- BOM:
- FAB DWG:
- PCB DWG:
- ASSY DWG:
- SCALE:
- A2
- SIZE
- CAGE CODE
- FILE NAME
- DWG NO.
- SHEET
- OF
- REV

### Library data of the parts
C1 = CAP 10nF 50V: CAP CER 10000PF 50V X7R 0603; Tolerance: 10%; Package: 0805; Value: 10nF; Rating: 50V; Temperature Coefficient: X7R; Operating Temperature: -55°C ~ 125°C; Part Number: CAP 10nF 50V
C2 C3 C15 = CAP 10uF 35V: CAP CER 10UF 35V X7R 0805; Manufacturer Part Number 1: GRM21BR6YA106KE43L; Tolerance: 10%; Temperature Coefficient: X5R; Package: 0805; Value: 10uF; Operating Temperature: -55°C ~ 125°C; Part Number: CAP 10uF 35V; Supplier 1: Digi-Key; Supplier Part Number 1: 490-10514-1-ND
  C2 C3: Rating: 35V
C4 = CAP 1.0uF 35V: CAP CER 1.0UF 35V X7R 0805; Tolerance: 10%; Package: 0603/0805; Temperature Coefficient: X7R; Operating Temperature: -55°C ~ 125°C; Value: 1.0uF; Part Number: CAP 1.0uF 35V
C5-C7 C11-C13 = CAP 22uF 16V: CAP CER 22UF 16V X5R 0805; Tolerance: 10%; Package: 0805; Temperature Coefficient: X5R; Operating Temperature: -55°C ~ 85°C; Value: 22uF; Part Number: CAP 22uF 16V
C8 C9 C16 = CAP 10uF 16V: CAP CER 10UF 16V X5R 0603/0805; Tolerance: 10%; Package: 0603/0805; Temperature Coefficient: X5R; Operating Temperature: -55°C ~ 85°C; Value: 10uF; Part Number: CAP 10uF 16V
C10 = CAP 0.10uF 16V: as C57 on sheet Power-MCU-Breakout; Temperature Coefficient: X5R; Value: 0.10uF; Part Number: CAP 0.10uF 16V; Package: 0603/0805; Operating Temperature: -55°C ~ 85°C
C14 = CAP 1500pF 25V: CAP CER 1500pF 25V X7R 0603; Tolerance: 1%; Package: 0603; Temperature Coefficient: X7R; Operating Temperature: -55C - +125C; Value: 1.5nF; Part Number: CAP 1500pF 25V
D2 = DIODE SCHOTTKY 80V 5A: Diode Schottky 80V 5A Surface Mount SMA; Manufacturer Part Number 1: SK58L-TP; Voltage - Forward (Vf) (Max) @ If: 850 mV @ 5 A; Voltage - DC Reverse (Vr) (Max): 80V; Package: DO-214AB; Current - Average Rectified (Io): 5A; Supplier 1: Digi-Key; Supplier Part Number 1: SK58L-TPMSCT-ND; Part Number: DIODE SCHOTTKY 80V 5A; Supplier URL 1: https://www.digikey.com/en/products/detail/SK58L-TP/SK58L-TPMSCT-ND/4966298?curr=usd&utm_campaign=buynow&utm_medium=aggregator&utm_source=octopart
D3 D5 = LED GREEN SMD: Typical RED, GREEN, YELLOW, AMBER GaAs LED; Package: 1206; Part Number: LED GREEN SMD; Pin Count: 2
D4 D6 = DIODE SCHOTTKY 20V 1A: Diode Schottky 20V 1A Surface Mount SOD-123FL; MF: Micro Commercial Co; ComponentLink1Description: digikey; ComponentLink1URL: https://www.digikey.ca/product-detail/en/on-semiconductor/MBR0540T1G/MBR0540T1GOSCT-ND/917967; Digikey: SM5817PL-TPMSCT-ND; Digikey Link: https://www.digikey.ca/product-detail/en/micro-commercial-co/SM5817PL-TP/SM5817PL-TPMSCT-ND/1793410; MP: SM5817PL-TP; Voltage Rating: 20V; Package: SOD-123; Current Rating: 1A; Part Number: DIODE SCHOTTKY 20V 1A; Supplier URL 1: https://www.digikey.ca/product-detail/en/on-semiconductor/MBR0540T1G/MBR0540T1GOSCT-ND/917967; Pin Count: 2
F2 = FUSE 3A 63V SLOW: FUSE 3A 63V AC/DC SLOW 1206; Response Time: Slow Blow; Operating Temperature: -55°C ~ 90°C; Voltage Rating - DC: 63V; Part Number: FUSE 3A 63V SLOW; Pin Count: 2
L1 = IND 33UH 8A 58 MOHM SMD: 33µH Shielded Wirewound Inductor 8A 58mOhm Max Nonstandard; MF: Bourns; SnapEDA_Link: https://www.snapeda.com/parts/SRP1265A-330M/Bourns/view-part/55645/?ref=snap; Availability: Unavailable; Value: *; Package: 1008 Bourns; MP: SRP1265A-330M; Price: None; Supplier 1: Digi-Key; Supplier 2: Newark; Supplier 3: Mouser; Part Number: IND 33UH 8A 58 MOHM SMD; Manufacturer Part Number 1: SRP1265A-330M; Supplier Part Number 1: SRP1265A-330MCT-ND; Supplier URL 1: https://www.digikey.com/en/products/detail/bourns-inc/SRP1265A-330M/4876626?s=N4IgTCBcDaIMoCUAKBGMA2ArAQQLQGZ8AGAWRAF0BfIA
L2 = IND 3.3UH 12A 12 MOHM SMD: 3.3uH 12A Shielded Molded Inductor 12mOhm Max; Mfr_Name: Vishay; Type: DEV; Copyright: Copyright (C) 2021 Ultra Librarian. All rights reserved.; Manufacturer_Part_Number: IHLP5050CEER3R3M01; Digi-Key_Part_Number_1: 541-1020-1-ND; Digi-Key_Part_Number_2: 541-1020-2-ND; Digi-Key_Part_Number_3: 541-1020-6-ND; RefDes: RefDes; Supplier 1: Digi-Key; Supplier Part Number 1: 541-1020-1-ND; Part Number: IND 3.3UH 12A 12 MOHM SMD; Manufacturer Part Number 1: IHLP5050CEER3R3M01; Supplier URL 1: https://www.digikey.com/en/products/detail/vishay-dale/IHLP5050CEER3R3M01/1220725?s=N4IgTCBcDaIJIAkAyAFArABkwYQKK4CUBmYgWQwEYQBdAXyA
R9 R18#2 = RES 47k 1/8W - 5%: RES SMD 47k OHM 5% 1/8W 0603; Power (Watts): 0.125W; Package: 0805; Value: 47k; Tolerance: 5%; Part Number: RES 47k 1/8W - 5%
R10 = RES 8.45k 1/8W: RES SMD 8.45k OHM 1% 1/8W 0603; Power (Watts): 0.125W; Package: 0603; Value: 8.45k; Tolerance: 1%; Part Number: RES 8.45k 1/8W
R11 = RES 383k 1/10W: RES SMD 383k OHM 1% 1/10W 0603; Power (Watts): 0.1W; Package: 0603; Value: 383k; Tolerance: 1%; Part Number: RES 383k 1/10W
R12 = RES 10k 1/8W - 5%: as R61 on sheet Power-MCU-Breakout; Package: 0805; Value: 10k; Tolerance: 5%; Part Number: RES 10k 1/8W - 5%
R13 = RES 1k 1/8W: as R60 on sheet Power-MCU-Breakout; Package: 0805; Value: 1k; Tolerance: 1%; Part Number: RES 1k 1/8W; Supplier 1: Digi-Key; Supplier Part Number 1: MCT0603-1.00K-CFCT-ND; Supplier URL 1: https://www.digikey.ca/en/products/detail/vishay-beyschlag-draloric-bc-components/MCT06030C1001FP500/2607821?s=N4IgTCBcDaILIGEAqAGAbCgzAWgIwDoUUBpbBAMWWwDkAREAXQF8g
R14 = RES 100k 1/8W - 5%: RES SMD 100K OHM 5% 1/8W 0603; Power (Watts): 0.125W; Package: 0805; Value: 100k; Tolerance: 5%; Part Number: RES 100k 1/8W - 5%
R15 = RES 4.3k 1/8W: RES SMD 4.3K OHM 1% 1/8W 0603; Power (Watts): 0.125W; Tolerance: 5%; Package: 0805; Value: 4.3k; Part Number: RES 4.3k 1/8W
R16 = RES 47k 1/8W - 1%: RES SMD 47K OHM 1% 1/8W 0603; Manufacturer Part Number 1: MCT06030C4702FP500; Power (Watts): 0.125W; Package: 0805; Value: 47k; Tolerance: 1%; Part Number: RES 47k 1/8W - 1%; Supplier 1: Digi-Key; Supplier Part Number 1: MCT0603-47.0K-CFCT-ND; Supplier URL 1: https://www.digikey.ca/en/products/detail/vishay-beyschlag-draloric-bc-components/MCT06030C4702FP500/2607854?s=N4IgTCBcDaILIGEAqAGAbCgzAWgCwHYA6FAaWwQDFlsA5AERAF0BfIA
R17 = RES 820.0 1/8W: RES SMD 820 OHM 5% 1/8W 0603; Power (Watts): 0.125W; Package: 0603; Value: 820; Tolerance: 5%; Part Number: RES 820.0 1/8W
R19 = RES 110.0 1/8W - 1%: RES SMD 110 OHM 1% 1/8W 0603; Manufacturer Part Number 1: RMCF0603FT110R; Power (Watts): 0.125W; Package: 0603; Value: 110; Tolerance: 1%; Part Number: RES 110.0 1/8W - 1%; Supplier 1: Digi-Key; Supplier Part Number 1: RMCF0603FT110RCT-ND; Supplier URL 1: https://www.digikey.ca/en/products/detail/stackpole-electronics-inc/RMCF0603FT110R/1761268
R20 = RES 1.96k 1/8W: RES SMD 1.96K OHM 1% 1/8W 0603; Manufacturer Part Number 1: RC0603FR-071K96L; Power (Watts): 0.125W; Package: 0805; Value: 1.96k; Tolerance: 1%; Part Number: RES 1.96k 1/8W; Supplier 1: Digi-Key; Supplier Part Number 1: 311-1.96KHRCT-ND; Supplier URL 1: https://www.digikey.ca/en/products/detail/yageo/RC0603FR-071K96L/726878
U2 = LM22677TJ-ADJ: Buck Switching Regulator IC Positive Adjustable 1.285V 1 Output 5A TO-263-7 Thin; Package: None; Price: None; Value: *; MP: LM22677TJ-ADJ; Availability: Unavailable; Part Number: LM22677TJ-ADJ; Manufacturer Part Number 1: LM22677TJ-ADJ; Supplier 1: Digi-key; Supplier Part Number 1: LM22677TJ-ADJ/NOPBCT-ND; Supplier URL 1: https://www.digikey.ca/en/products/detail/texas-instruments/LM22677TJ-ADJ-NOPB/1951971?s=N4IgTCBcDaIDIFkxgGwHY0BUBSBaAggCLYgC6AvkA
U3 = BD9C601EFJ-E2: Buck Switching Regulator IC Positive Adjustable 0.8V 1 Output 6A 8-SOIC (0.154", 3.90mm Width) Exposed Pad; Mfr_Name: ROHM Semiconductor; Copyright: Copyright (C) 2021 Ultra Librarian. All rights reserved.; Manufacturer_Part_Number: BD9C601EFJ-E2; Digi-Key_Part_Number_1: 846-1115-2-ND; Digi-Key_Part_Number_2: 846-1115-1-ND; Digi-Key_Part_Number_3: 846-1115-6-ND; RefDes: RefDes; Type: DEV; Supplier 1: Digi-key; Supplier 2: Newark; Supplier 3: Avnet; Supplier 4: Farnell; Supplier Part Number 1: 846-1115-1-ND; Supplier Part Number 2: 53X2986; Supplier Part Number 3: BD9C601EFJ-E2; Supplier Part Number 4: 2420849; Part Number: BD9C601EFJ-E2; Manufacturer Part Number 1: BD9C601EFJ-E2; Supplier URL 1: https://www.digikey.ca/en/products/detail/rohm-semiconductor/BD9C601EFJ-E2/4022633?s=N4IgTCBcDaIEIBECcBhAbABgIwFEBiAUgLQ4QC6AvkA
U4 = NCP1117DT33T5G: Linear Voltage Regulator IC Positive Fixed 1 Output 1A DPAK; Supplier 1: Digi-Key; Supplier Part Number 1: NCP1117DT33T5GOSCT-ND; Part Number: NCP1117DT33T5G; Manufacturer Part Number 1: NCP1117DT33T5G; Supplier URL 1: https://www.digikey.ca/en/products/detail/onsemi/NCP1117DT33T5G/921285
3V3 5FB 5V 12FB 12V = Test Point (Via): Part Number: Test Point (Via)

## Nets that join several sheets
3V3: breakbeam-interface (J6.1 J7.2), communication (C45.2 J13.2 R69.2 U8.16), flyback (R34.1 R35.1), geneva-interface (J11.4 R18#1.1 R57.1), HV-Measurement (C36.2 C37.1 U6.5), power-input (R5.2 R6.2), Power-MCU-Breakout (18 pins), regulation (3V3.1 C16.2 R19.2 U4.2)
5V: communication (8 pins), regulation (7 pins)
5V_FLASH: Power-MCU-Breakout (R73.1), regulation (F2.1)
12V: chicker (C39.2 C40.2 U7.6), flyback (8 pins), geneva-interface (J8.2), regulation (11 pins)
+HV: auto-discharge (R42.2 R43.2), chicker (D12.1 D14.1 P2.2 P3.2), flyback (7 pins), HV-Measurement (R47.2)
GND: breakbeam-interface (J6.3 J7.1), chicker (C39.1 C40.1 U7.3), communication (16 pins), flyback (R36.1), geneva-interface (7 pins), HV-Measurement (7 pins), power-input (GND.1 R4.1), Power-MCU-Breakout (15 pins), regulation (D3.2)
PGND: auto-discharge (D9.A Q4.S Q6.2 R46.1), chicker (10 pins), communication (8 pins), flyback (27 pins), geneva-interface (J8.1), power-input (9 pins), regulation (28 pins)
VCC: auto-discharge (R45.2), communication (D16.1 Q9.3 R55.1), flyback (19 pins), power-input (R7.1 R8.1 U1.10), regulation (6 pins)
BREAKBEAM: breakbeam-interface (BKBM.1 J6.2), Power-MCU-Breakout (U11.6)
CHARGE: flyback (CHARGE.1 R36.2 U5.6), Power-MCU-Breakout (U11.14)
CHIP: chicker (U7.2), Power-MCU-Breakout (U11.13)
DONE: flyback (*DONE.1 R34.2 U5.5), Power-MCU-Breakout (U11.15)
FAULT: flyback (*FAULT.1 R35.2 U5.4), Power-MCU-Breakout (U11.16)
GENEVA_DIR: geneva-interface (D17.1 G_DIR.1 J8.5), Power-MCU-Breakout (U11.24)
GENEVA_ENCODER_A: geneva-interface (D17.4 G_ENCA.1 J11.2), Power-MCU-Breakout (U11.35)
GENEVA_ENCODER_B: geneva-interface (D17.5 G_ENCB.1 J11.3), Power-MCU-Breakout (U11.34)
GENEVA_END_STOP_1: geneva-interface (C54.1 J9.1 R18#1.2), Power-MCU-Breakout (U11.28)
GENEVA_END_STOP_2: geneva-interface (C55.1 J10.1 R57.2), Power-MCU-Breakout (U11.29)
GENEVA_SPEED: geneva-interface (D17.3 G_SPD.1 J8.4), Power-MCU-Breakout (U11.21)
HV-SENSE: HV-Measurement (5 pins), Power-MCU-Breakout (U11.5)
JETSON_RX: communication (U8.12), Power-MCU-Breakout (R68.2)
JETSON_TX: communication (U8.11), Power-MCU-Breakout (R65.1)
KICK: chicker (U7.4), Power-MCU-Breakout (U11.12)
PMS_SCL: power-input (R5.1 R67.2), Power-MCU-Breakout (U11.17)
PMS_SDA: power-input (R6.1 R66.2), Power-MCU-Breakout (U11.20)

## Assembly variants
Production: not fitted R72